# EAGLE design BiasController (EAGLE 7.7.0)
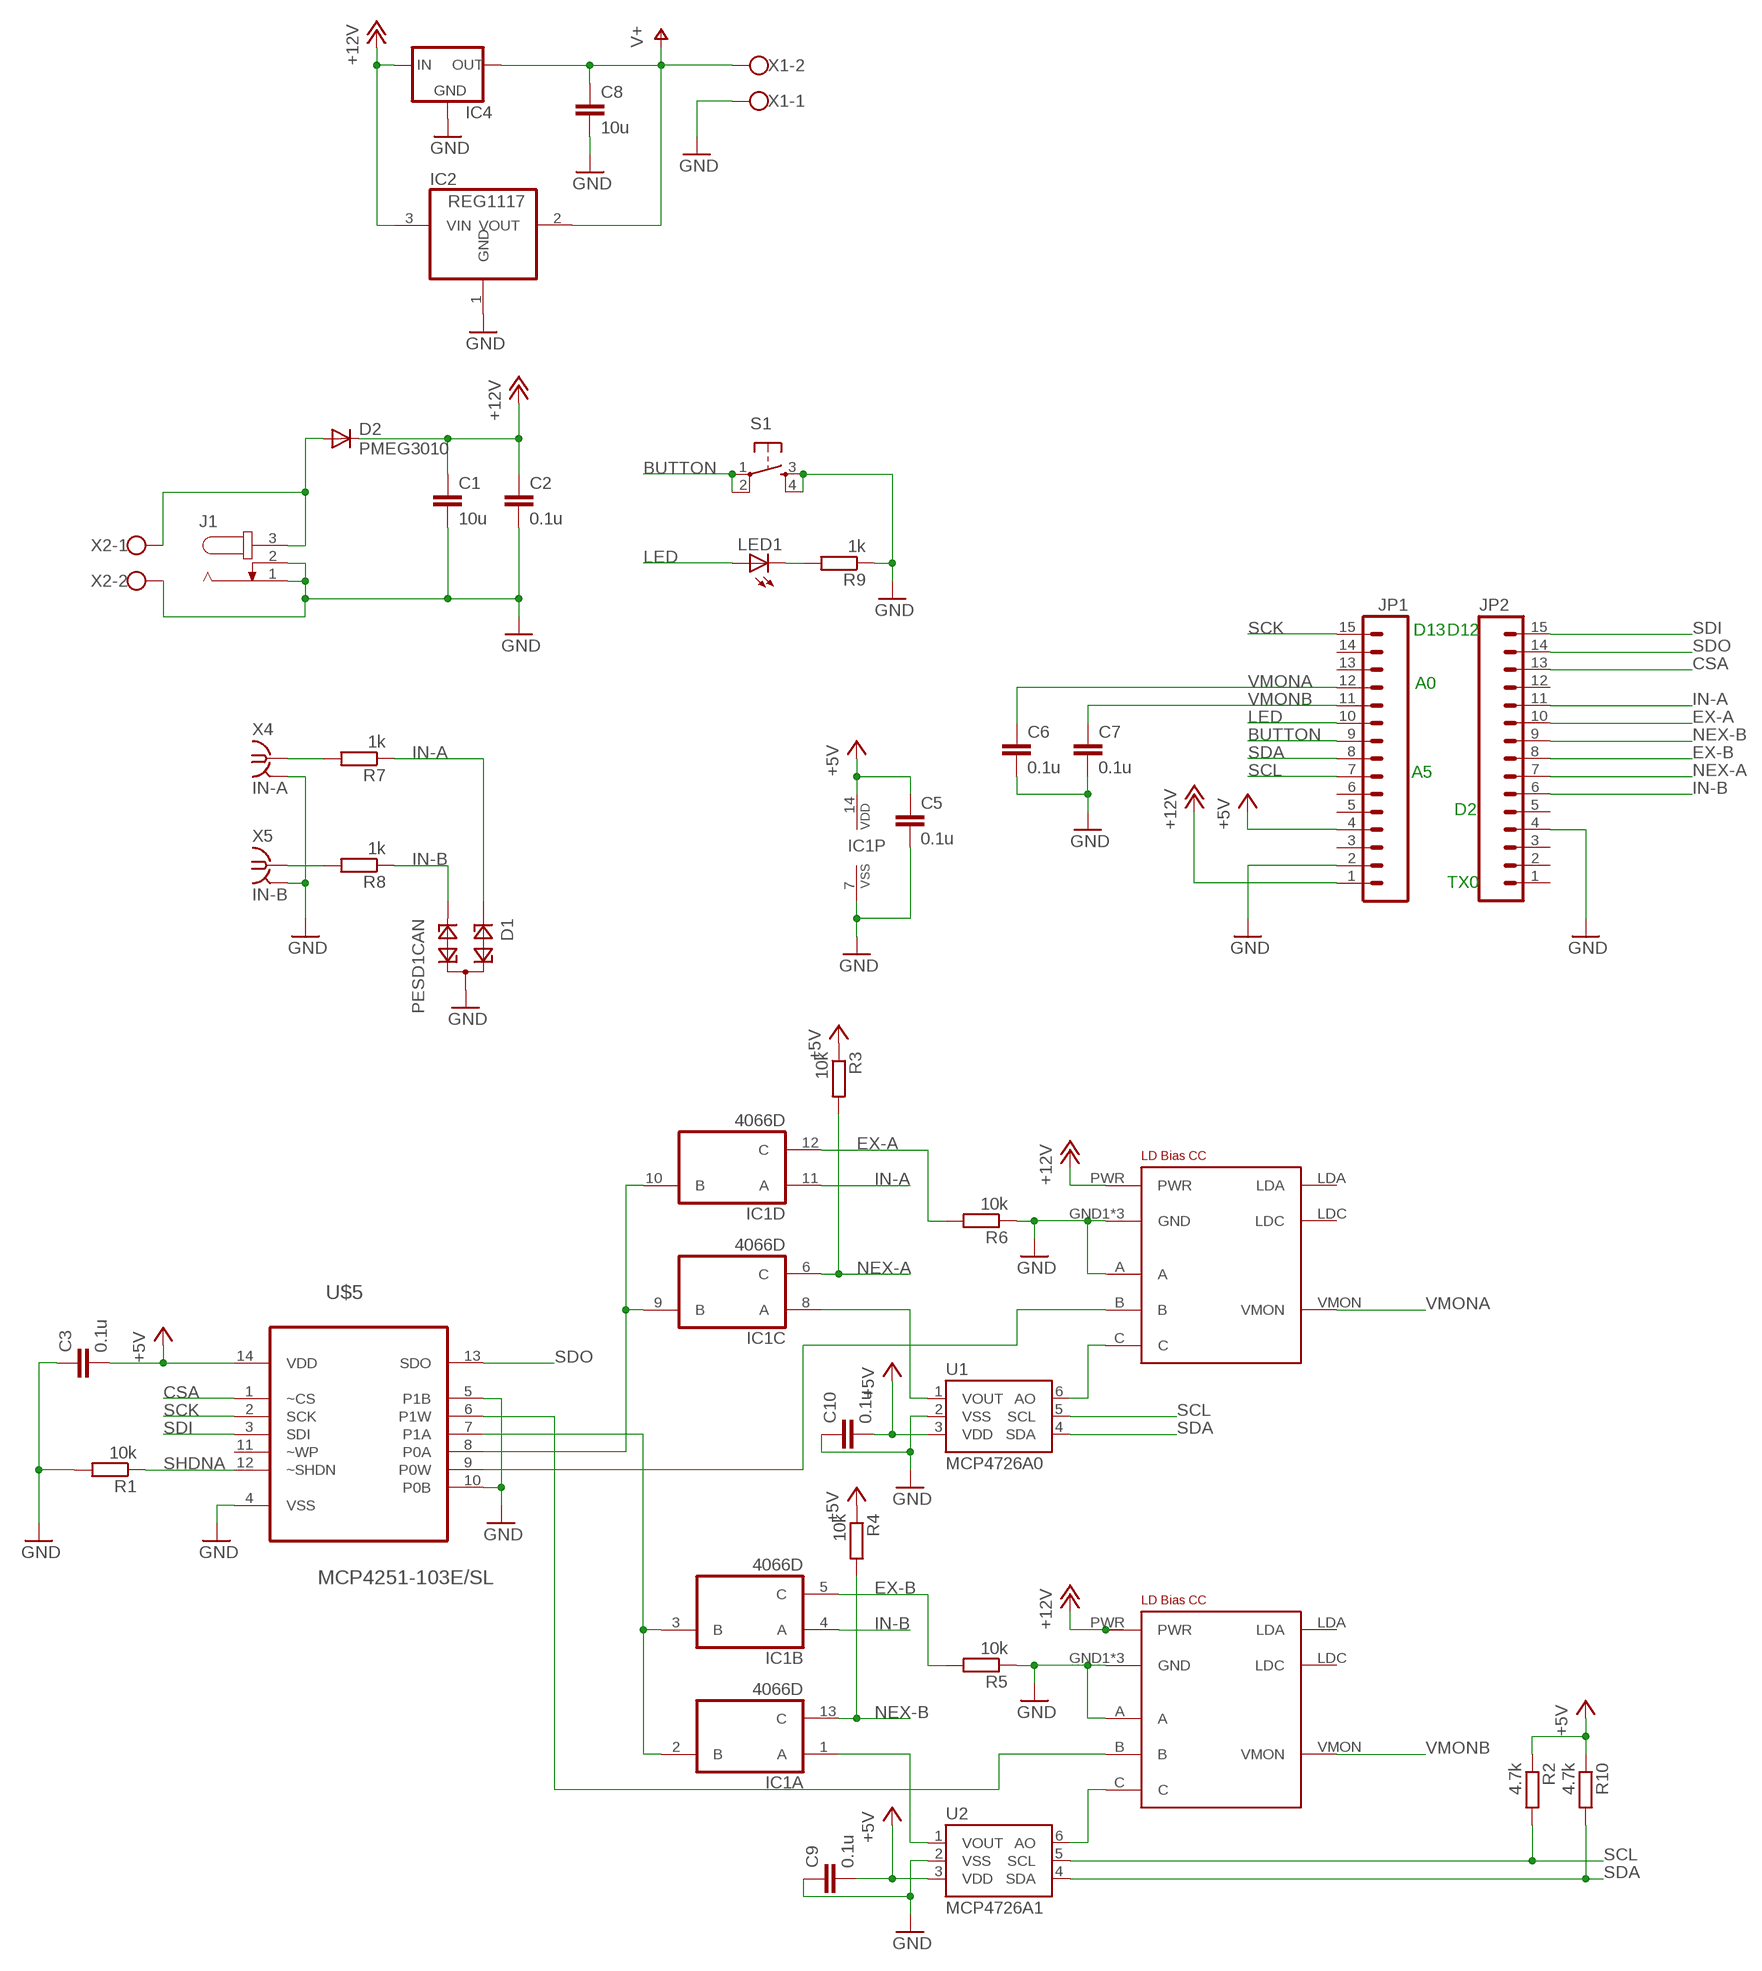
[diagram p0: schematic, sheet 1]

## Parts
C1  10u  C-EUC0805  [C0805]
C2  0.1u  C-EUC0805  [C0805]
C3  0.1u  C-EUC0805  [C0805]
C5  0.1u  C-EUC0805  [C0805]
C6  0.1u  C-EUC0805  [C0805]
C7  0.1u  C-EUC0805  [C0805]
C8  10u  C-EUC0805  [C0805]
C9  0.1u  C-EUC0805  [C0805]
C10  0.1u  C-EUC0805  [C0805]
D1  PESD1CAN  [SOT23]
D2  PMEG3010  DIODESOD  [SOD-323]
IC1  4066D  [SO14]
IC2  REG1117  [SOT223]
IC4  78XXS  [78XXS]
J1  JACK-PLUG0  [SPC4077]
JP1  M15LOCK_LONGPADS  [1X15_LOCK_LONGPADS]
JP2  M15LOCK_LONGPADS  [1X15_LOCK_LONGPADS]
LED1  LED0603  [LED-0603]
R1  10k  R-EU_R0805  [R0805]
R2  4.7k  R-EU_R0805  [R0805]
R3  10k  R-EU_R0805  [R0805]
R4  10k  R-EU_R0805  [R0805]
R5  10k  R-EU_R0805  [R0805]
R6  10k  R-EU_R0805  [R0805]
R7  1k  R-EU_R0805  [R0805]
R8  1k  R-EU_R0805  [R0805]
R9  1k  R-EU_R0805  [R0805]
R10  4.7k  R-EU_R0805  [R0805]
S1  TAC_SWITCHPTH  [TACTILE-PTH]
U1  MCP4726A0  MCP4725SOT-23  [SOT23-6]
U2  MCP4726A1  MCP4725SOT-23  [SOT23-6]
U$1  LDBIASCC  [LDBIASDRIVERCC]
U$2  LDBIASCC  [LDBIASDRIVERCC]
U$5  MCP4251-103E/SL  [SOIC127P600X175-14N]
X1  W237-102  [W237-102]
X2  W237-102  [W237-102]
X4  IN-A  SMA-142-0711-821/826  [J502-ND-142-0711-821/826]
X5  IN-B  SMA-142-0711-821/826  [J502-ND-142-0711-821/826]

## Nets
+5V: C3.2 C5.1 C9.2 C10.2 IC1.14(P:VDD) JP1.4 R2.1 R3.1 R4.1 R10.1 U1.3(VDD) U2.3(VDD) U$5.14(VDD)
+12V: C1.1 C2.1 D2.1(C) IC2.3(VIN) IC4.IN JP1.1 U$1.PWR U$2.PWR
BUTTON: JP1.9 S1.1 S1.2
CSA: JP2.13 U$5.1(~CS)
EX-A: IC1.12(D:C) JP2.10 R6.2
EX-B: IC1.5(B:C) JP2.8 R5.2
GND: C1.2 C2.2 C3.1 C5.2 C6.2 C7.2 C8.2 C9.1 C10.1 D1.3 IC1.7(P:VSS) IC2.1(GND) IC4.GND J1.1 J1.2 JP1.2 JP2.4 R1.2 R5.1 R6.1 R9.1 S1.3 S1.4 U1.2(VSS) U2.2(VSS) U$1.A U$1.GND1(GND) U$1.GND2(GND) U$1.GND3(GND) U$2.A U$2.GND1(GND) U$2.GND2(GND) U$2.GND3(GND) U$5.4(VSS) U$5.5(P1B) U$5.10(P0B) X1.1 X2.2 X4.G@1 X4.G@2 X4.G@3 X4.G@4 X5.G@1 X5.G@2 X5.G@3 X5.G@4
IN-A: D1.1 IC1.11(D:A) JP2.11 R7.1
IN-B: D1.2 IC1.4(B:A) JP2.6 R8.1
LED: JP1.10 LED1.A
N$1: U1.6(AO) U$1.C
N$2: IC1.8(C:A) U1.1(VOUT)
N$3: U$1.B U$5.9(P0W)
N$4: IC1.9(C:B) IC1.10(D:B) U$5.8(P0A)
N$6: IC1.2(A:B) IC1.3(B:B) U$5.7(P1A)
N$7: U2.6(AO) U$2.C
N$9: D2.2(A) J1.3 X2.1
N$10: LED1.C R9.2
N$13: R7.2 X4.1
N$14: R8.2 X5.1
N$19: IC1.1(A:A) U2.1(VOUT)
N$20: U$2.B U$5.6(P1W)
NEX-A: IC1.6(C:C) JP2.7 R3.2
NEX-B: IC1.13(A:C) JP2.9 R4.2
SCK: JP1.15 U$5.2(SCK)
SCL: JP1.7 R2.2 U1.5(SCL) U2.5(SCL)
SDA: JP1.8 R10.2 U1.4(SDA) U2.4(SDA)
SDI: JP2.15 U$5.3(SDI)
SDO: JP2.14 U$5.13(SDO)
SHDNA: R1.1 U$5.12(~SHDN)
V+: C8.1 IC2.2(VOUT) IC4.OUT X1.2
VMONA: C6.1 JP1.12 U$1.VMON
VMONB: C7.1 JP1.11 U$2.VMON
Unconnected: JP1.3 JP1.5 JP1.6 JP1.13 JP1.14 JP2.1 JP2.2 JP2.3 JP2.5 JP2.12 U$1.LDA U$1.LDC U$2.LDA U$2.LDC U$5.11(~WP)

## Notes on the sheet
- D13 | D12
- A0
- A5
- D2
- TX0

## Library data of the parts
C1-C3 C5-C10 = rcl:C-EU: CAPACITOR, European symbol
D1 = diode:PESD1CAN: CAN bus ESD protection diode Source: http://www.nxp.com/documents/data_sheet/PESD1CAN.pdf
D2 = SparkFun:DIODE: Diode These are standard reverse protection diodes and small signal diodes. SMA package can handle up to about 1A. SOD-323 can handle about 200mA. What the SOD-323 package when ordering, there are some mfgs out there that are 5-pin packages.
IC1 = 40xx:4066: Quad bilateral ANALOG SWITCH
IC2 = burr-brown:REG1117: 800mA and 1A Low Dropout (LDO) Positive Regulator 1.8V, 2.5V, 2.85V, 3.3V, 5V, and Adj; MPN: REG1117; OC_FARNELL: 1097566; OC_NEWARK: 14P6981
IC4 = v-reg:78XXS: VOLTAGE REGULATOR
J1 = con-jack:JACK-PLUG: DC POWER JACK Power Jack, DC, Right Angle, Through Hole, Rated 5A at 16VDC, PC Terminals Distributor: Farnell (www.Farnell.de) Drawing: 84N1161.pdf / 84N1162.pdf Manufacturer: SPC Technology (www.spctechnology.com) Type: SPC4077 / SPC 4078; OC_FARNELL: unknown; OC_NEWARK: unknown
JP1 JP2 = SparkFun-Connectors:M15: Header 15 Standard 15-pin 0.1" header. Use with straight break away headers (SKU : PRT-00116), right angle break away headers (PRT-00553), swiss pins (PRT-00743), machine pins (PRT-00117), and female headers (PRT-00115).
LED1 = SparkFun:LED: LEDs Standard schematic elements and footprints for 5mm, 3mm, 1206, and 0603 sized LEDs. 5mm - Spark Fun Electronics SKU : COM-00529 (and others)
R1-R10 = rcl:R-EU_: RESISTOR, European symbol
S1 = SparkFun:TAC_SWITCH: Momentary Switch Button commonly used for reset or general input. Spark Fun Electronics SKU : COM-00097
U1 U2 = SparkFun-AnalogIC:MCP4725: Microchip 12-bit I2C DAC, SOT23-6; PROD_ID: IC-08886; VALUE: MCP4725
U$1 U$2 = Footprint:LDBIASCC
U$5 = Custom:MCP4251-103E/SL: Digital POT; MPN: MCP4251-103E/SL; OC_FARNELL: 1578444; OC_NEWARK: 27M0148; PACKAGE: SOIC-14; SUPPLIER: Microchip
X1 X2 = con-wago-500:W237-102: WAGO SCREW CLAMP; MPN: 237-102; OC_FARNELL: unknown; OC_NEWARK: 70K9898
X4 X5 = con-coax:SMA-: SMA 50 Ohm End Launch Jack Receptacle - Round Contact Johnson Components Source: www.johnsoncomponents.com .. J502-ND.pdf; MF: JOHNSON COMPONENTS; MPN: 142-0711-821; OC_FARNELL: 1019328; OC_NEWARK: 16F3627

## Board
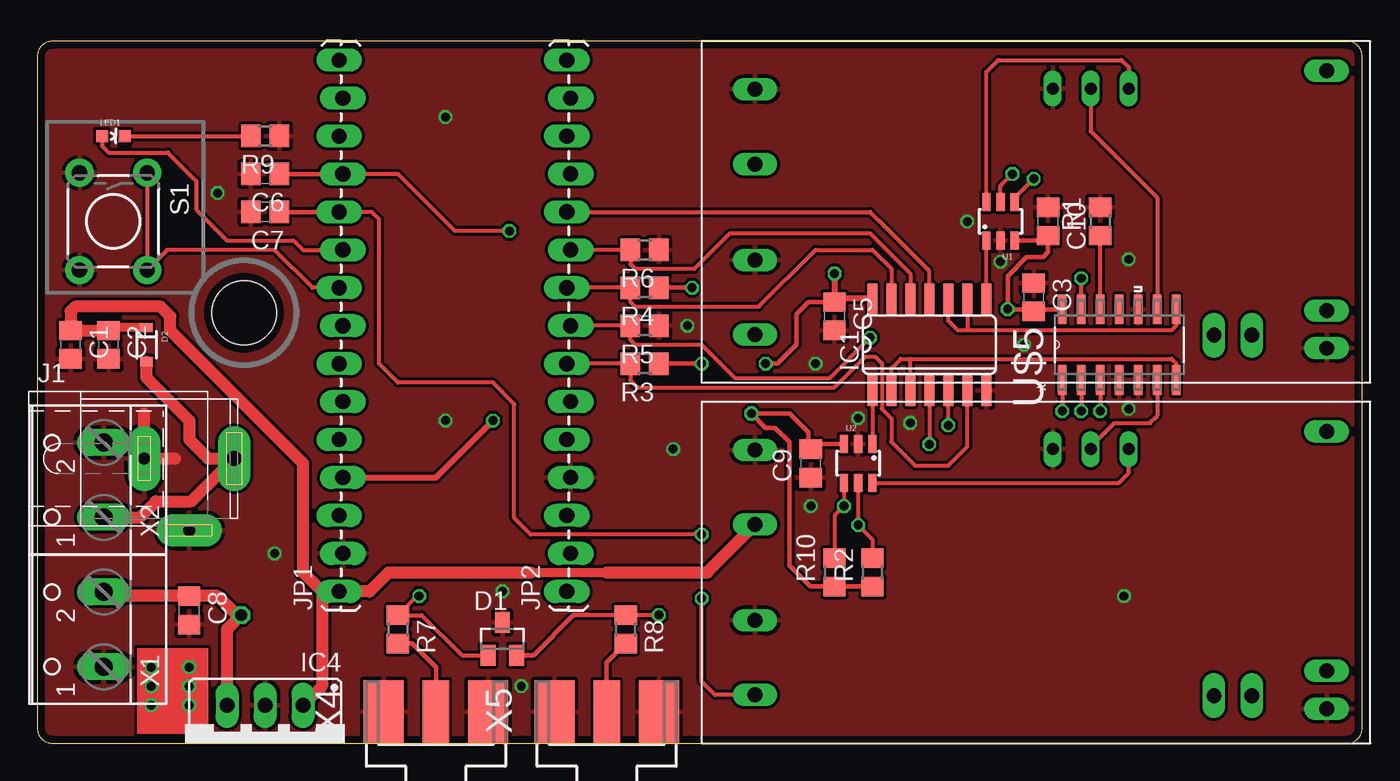
[diagram p1: board, top side]
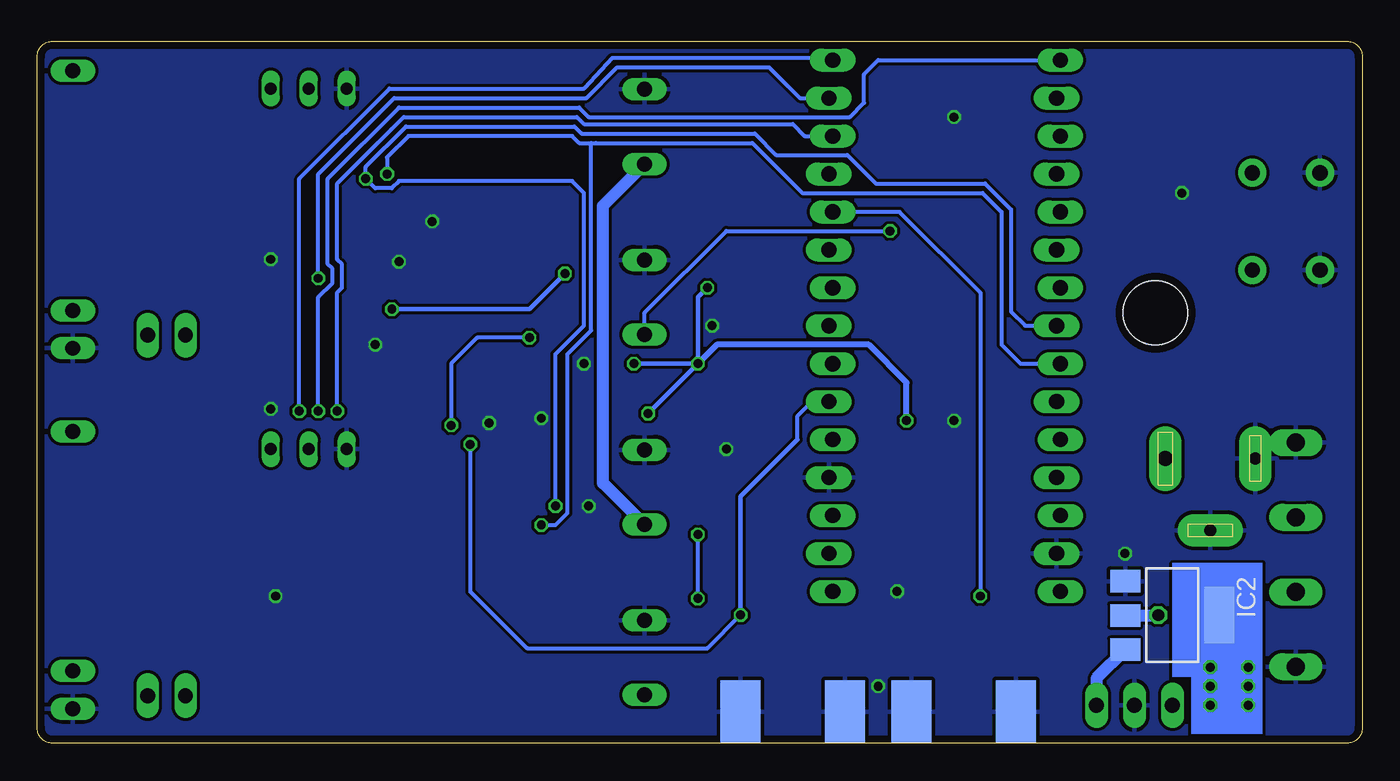
[diagram p2: board, bottom side, seen from below]

Size 88.65 x 46.98 mm. Coordinates in mm from the lower left corner, seen from the top.
Outline: 0,45.98 0,1 arc90 1,0 87.65,0 arc90 88.65,1 88.65,45.98 arc90 87.65,46.98 1,46.98 arc90 0,45.98
Copper layers (1*16): Top 0.035mm / dielectric 1.6mm / Bottom 0.035mm
Design rules "Elecrow_2-layer_PCB_eagle_rule *": minimum track width 6mil, minimum drill 12mil, track to track 8mil, track to pad 8mil, pad to pad 8mil, via to via 8mil, smd to smd 0mil, copper to edge 20mil, drill to drill 10mil, minimum pad ring 6mil, minimum via ring 6mil, stop-mask expansion 0mil, vias tented up to drill 100mil, thermal gap 10mil
Holes 4.3 mm at 13.83,28.81

### Footprints (pad centres in the part's own frame; a part is rotated, then mirrored left to right if it is on the bottom)
C0805 = smd 1.3 x 1.5: 1 -0.95,0; 2 0.95,0
SOT23 = smd 1 x 1.4: 1 -0.95,-1.1; 2 0.95,-1.1; 3 0,1.1
SOD-323 = smd 0.63 x 0.83: 1 -1.15,0; 2 1.15,0
SO14 = smd 0.66 x 2.032: 1 -3.81,-3.073; 2 -2.54,-3.073; 3 -1.27,-3.073; 4 0,-3.073; 5 1.27,-3.073; 6 2.54,-3.073; 7 3.81,-3.073; 8 3.81,3.073; 9 2.54,3.073; 10 1.27,3.073; 11 0,3.073; 12 -1.27,3.073; 13 -2.54,3.073; 14 -3.81,3.073
SOT223 = smd 1.499 x 2.007: 1 -2.261,-3.15; 2 0.025,-3.15; 3 2.311,-3.15 | smd 3.81 x 2.007: 4 0,3.15
78XXS = drill 1.016 long: GND 0,-2.54; IN -2.54,-2.54; OUT 2.54,-2.54
SPC4077 = drill 0.8 pad 2.184 long: 1 -3,0; 2 0,-4.8 | drill 1 pad 2.184 long: 3 3,0
1X15_LOCK_LONGPADS = drill 1.016 long: 1 0,0.127; 2 2.54,-0.127; 3 5.08,0.127; 4 7.62,-0.127; 5 10.16,0.127; 6 12.7,-0.127; 7 15.24,0.127; 8 17.78,-0.127; 9 20.32,0.127; 10 22.86,-0.127; 11 25.4,0.127; 12 27.94,-0.127; 13 30.48,0.127; 14 33.02,-0.127; 15 35.56,0.127
LED-0603 = smd 0.8 x 0.8: A 0,-0.75; C 0,0.75
R0805 = smd 1.3 x 1.5: 1 -0.95,0; 2 0.95,0
TACTILE-PTH = drill 1.016 pad 1.88: 1 -3.251,2.261; 2 3.251,2.261; 3 -3.251,-2.261; 4 3.251,-2.261
SOT23-6 = smd 0.55 x 1.2: 1 0.95,1.3; 2 0,1.3; 3 -0.95,1.3; 4 -0.95,-1.3; 5 0,-1.3; 6 0.95,-1.3
LDBIASDRIVERCC = drill 1 long: 1 36.83,3.175; 2 34.29,3.175; GND1 3.57,19.63; GND2 3.572,8.22; GND3 41.831,2.302; LDA 41.831,4.84; LDC 41.82,20.87; PWR 3.57,14.63; VMON 3.57,3.223 | drill 0.8 long: A 23.495,19.685; B 26.035,19.685; C 28.575,19.685
SOIC127P600X175-14N = smd 1.981 x 0.559: 1 -2.362,3.81; 2 -2.362,2.54; 3 -2.362,1.27; 4 -2.362,0; 5 -2.362,-1.27; 6 -2.362,-2.54; 7 -2.362,-3.81; 8 2.362,-3.81; 9 2.362,-2.54; 10 2.362,-1.27; 11 2.362,0; 12 2.362,1.27; 13 2.362,2.54; 14 2.362,3.81
W237-102 = drill 1.194 long: 1 -2.5,-1.27; 2 2.5,-1.27
J502-ND-142-0711-821/826 = smd 4.191 x 1.778: 1 2.115,0 | smd 4.191 x 2.667: G@1 2.115,3.495; G@2 2.115,-3.495 | smd 4.191 x 2.667 bottom: G@3 2.115,3.495; G@4 2.115,-3.495

### Placement (x,y rotation side)
C1  2.22,26.67 270 top
C2  4.76,26.67 270 top
C3  66.67,29.84 270 top
C5  53.34,28.57 270 top
C6  15.24,38.1 180 top
C7  15.24,35.56 180 top
C8  10.16,8.89 270 top
C9  51.75,18.73 90 top
C10  67.63,34.92 270 top
D1  31.11,6.99 0 top
D2  7.3,26.67 270 top
IC1  59.69,26.67 0 top
IC2  12.7,8.57 270 bottom
IC4  15.24,0 180 top
J1  10.16,19.05 0 top
JP1  20.32,10.16 90 top
JP2  35.56,10.16 90 top
LED1  5.08,40.64 270 top
R1  71.12,34.92 90 top
R2  55.88,11.43 90 top
R3  40.64,25.4 180 top
R4  40.64,30.48 180 top
R5  40.64,27.94 180 top
R6  40.64,33.02 180 top
R7  24.13,7.62 270 top
R8  39.37,7.62 270 top
R9  15.24,40.64 180 top
R10  53.34,11.43 90 top
S1  5.08,34.92 270 top
U1  64.45,34.92 180 top
U2  54.93,18.73 0 top
U$1  44.45,24.13 0 top
U$2  44.45,0 0 top
U$5  72.39,26.67 90 top
X1  3.18,7.62 90 top
X2  3.18,17.62 90 top
X4  26.67,0 90 top
X5  38.1,0 90 top

### Tracks (layer width: path | path; a pad name or v marks a point on that pad's centre or on a via)
+5V  (via drill 0.6)
  Top 0.305: v44.45,25.4 R3.1 | R4.1 v43.81,30.48 | U2.3 52.1,20.03 C9.2 51.59,19.84 51.59,20.8 50.32,22.07 v47.78,22.07 48.74,21.11 49.37,21.11 50.32,20.16 50.32,11.91 51.75,10.48 R10.1 R2.1 | U1.3 67.28,33.62 C10.2 67.63,32.86 67.31,32.54 66.2,32.54 64.93,31.27 v64.93,29.05 64.95,29.03 66.81,29.03 | U$5.14 66.81,29.03 | 66.81,29.03 C3.2 | C5.1 51.59,29.52 50.8,28.73 50.8,26.67 49.53,25.4 v48.74,25.4
  Top 0.406: IC1.14 53.12,29.74 C5.1 v53.34,31.43 | JP1.4 26.67,17.78 v30.48,21.59
  Bottom 0.305: v43.81,30.48 44.45,29.84 v44.45,25.4 | v44.45,25.4 v47.78,22.07 | v48.74,25.4 v44.45,25.4 | v64.93,29.05 55.72,29.05 v53.34,31.43
  Bottom 0.406: v30.48,21.59 30.48,24.13 33.02,26.67 43.18,26.67 v44.45,25.4
+12V
  Top 0.61: 33.02,11.43 38.1,11.43 | D2.1 4.64,27.82 C2.1
  Top 0.813: 19.05,10.16 17.78,11.43 17.78,18.73 8.89,27.62 8.89,28.57 8.26,29.21 2.54,29.21 2.22,28.89 C1.1 C2.1 | 33.02,11.43 23.5,11.43 22.23,10.16 JP1.1 19.05,10.16 | 38.1,11.43 44.82,11.43 U$2.PWR | 19.05,10.16 19.05,3.81 IC4.IN
  Bottom 0.813: IC2.3 17.78,4.33 IC4.IN | U$2.PWR 50.8,17.41 50.8,35.98 U$1.PWR
BUTTON
  Top 0.254: S1.1 S1.2 8.69,33.02 15.88,33.02 18.41,30.48 JP1.9
CSA  (via drill 0.6)
  Top 0.254: U$5.1 v68.58,22.23
  Bottom 0.254: v68.58,22.23 68.58,30.16 68.26,30.48 68.26,32.07 68.58,32.38 68.58,37.47 64.14,41.91 52.55,41.91 52.07,41.43 38.1,41.43 37.31,40.64 JP2.13
EX-A
  Top 0.254: JP2.10 R6.2 39.69,32.06 40,31.75 43.97,31.75 46.35,34.13 55.72,34.13 58.42,31.43 IC1.12
EX-B  (via drill 0.6)
  Top 0.254: R5.2 JP2.8 | R5.2 39.69,27.62 | v55.72,27.15 53.02,24.45 46.67,24.45 44.45,26.67 40,26.67 39.69,26.99 R5.2 | v60.96,21.27 IC1.5
  Bottom 0.254: v55.72,27.15 59.21,27.15 60.96,25.4 v60.96,21.27
GND  (via drill 0.6)
  Top 0.813: 7.14,19.21 7.14,22.07 | 7.3,19.05 9.21,19.05
  other vias: 66.04,26.67 42.54,19.68 72.71,9.84 12.07,36.83 27.3,21.59 43.5,27.94 15.88,12.7 32.38,3.81 31.11,10.16 58.42,21.43 51.75,15.88 54.93,21.75 64.45,32.23 62.23,34.92 52.07,25.4 73.03,22.38 27.3,41.91 73.03,32.38
  pour Bottom: -1.27,48.26 88.9,46.99 88.9,0 0,0
  pour Top: 0,0 -1.27,48.26 88.9,48.26 88.9,0
IN-A  (via drill 0.6)
  Top 0.254: IC1.11 59.69,31.59 57.07,34.21 56.67,34.61 55.72,35.56 JP2.11 | D1.1 28.41,5.88 25.72,8.57 R7.1 25.4,9.84 v25.56,9.84
  Bottom 0.254: v25.56,9.84 25.56,30.16 30.96,35.56 JP2.11
IN-B  (via drill 0.6)
  Top 0.254: IC1.4 v59.69,20
  Top 0.305: 39.05,8.57 v41.59,8.57 | D1.2 33.19,5.88 35.88,8.57 36.83,8.57 R8.1
  Top 0.406: R8.1 39.05,8.57
  Bottom 0.254: 37.78,20.32 37.78,21.91 36.83,22.86 JP2.6 34.29,22.86 | v59.69,20 59.69,10.16 55.88,6.35 43.81,6.35 v41.59,8.57
  Bottom 0.305: 37.78,20.32 41.59,16.51 v41.59,8.57
LED
  Top 0.254: LED1.A 4.33,39.96 4.76,39.53 8.73,39.53 10.64,37.62 10.64,35.72 12.7,33.66 17.14,33.66 17.78,33.02 JP1.10
N$1
  Top 0.254: U1.6 63.5,39.69 63.5,44.93 64.29,45.72 72.55,45.72 73.03,45.24 U$1.C
N$2
  Top 0.254: IC1.8 U1.1
N$3
  Top 0.254: U$1.B 70.48,40.96 74.93,36.51 U$5.9
N$4
  Top 0.254: U$5.8 76.2,27.94 75.88,27.62 62.23,27.62 | 62.23,27.62 61.59,27.62 60.96,28.26 IC1.10 | IC1.9 62.23,27.62
N$6
  Top 0.254: IC1.2 57.15,25.08 57.78,25.72 58.42,25.72 | 58.42,25.72 75.88,25.72 76.2,25.4 U$5.7 | IC1.3 58.42,25.72
N$7
  Top 0.254: U2.6 72.36,17.43 73.03,18.1 U$2.C
N$9
  Top 0.813: 13.34,17.78 13.16,17.32 J1.3 | 13.16,19.98 J1.3 | J1.3 11.43,19.05 10.16,20.32 10.16,21.59 7.3,24.45 D2.2 | X2.1 6.87,15.12 7.94,16.19 10.3,16.19 J1.3
N$10
  Top 0.254: LED1.C R9.2
N$11  (via drill 0.6)
  other vias: 7.62,2.54
N$12  (via drill 0.6)
  other vias: 10.16,2.54
N$13
  Top 0.305: R7.2 25.08,6.67 26.67,5.08 X4.1
N$14
  Top 0.305: X5.1 38.1,5.4 R8.2
N$15  (via drill 0.6)
  other vias: 7.62,3.81
N$16  (via drill 0.6)
  other vias: 10.16,3.81
N$17  (via drill 0.6)
  other vias: 10.16,5.08
N$18  (via drill 0.6)
  other vias: 7.62,5.08
N$19
  Top 0.254: IC1.1 U2.1
N$20
  Top 0.254: U$5.6 74.93,21.91 74.45,21.43 72.07,21.43 70.48,19.84 U$2.B
NEX-A
  Top 0.254: JP2.7 R3.2 39.69,24.29 40.16,23.81 53.34,23.81 55.4,25.88 56.04,25.88 56.51,25.4 56.51,22.38 57.15,21.75 57.15,20.16 58.74,18.57 60.96,18.57 62.23,19.84 IC1.6
NEX-B
  Top 0.254: R4.2 JP2.9 | R4.2 39.69,30.16 | IC1.13 57.15,31.75 55.88,33.02 52.07,33.02 48.26,29.21 40,29.21 39.69,29.53 R4.2
SCK  (via drill 0.6)
  Top 0.254: U$5.2 v69.85,22.23
  Bottom 0.254: v69.85,22.23 69.85,29.84 68.9,30.8 68.9,31.75 69.22,32.07 69.22,37.78 64.45,42.55 52.39,42.55 51.75,41.91 34.29,41.91 33.34,42.86 33.34,44.77 32.38,45.72 JP1.15
SCL  (via drill 0.6)
  Top 0.254: U1.5 64.45,37.31 v65.25,38.1 | U2.5 v54.93,14.61 55.88,13.65 R2.2
  Bottom 0.254: JP1.7 22.86,25.4 24.13,26.67 24.13,35.56 25.4,36.83 37.46,36.83 40.8,40.16 51.28,40.16 51.59,40.16 | 51.59,40.16 52.39,40.16 52.86,40.64 63.82,40.64 65.25,39.21 v65.25,38.1 | v54.93,14.61 53.97,14.61 53.18,15.4 53.18,26.04 51.59,27.62 51.59,40.16
SDA  (via drill 0.6)
  Top 0.254: U1.4 65.4,36.51 v66.67,37.78 | U2.4 v53.98,15.88 v53.97,15.88 53.34,15.24 R10.2
  Bottom 0.254: JP1.8 22.54,27.94 23.5,28.89 23.5,35.72 25.24,37.47 32.54,37.47 34.45,39.37 39.21,39.37 40.64,40.8 52.23,40.8 52.7,41.27 63.98,41.27 66.67,38.58 v66.67,37.78 66.04,37.15 64.93,37.15 64.45,37.62 52.86,37.62 52.07,36.83 52.07,27.94 53.97,26.04 v53.97,15.88
SDI  (via drill 0.6)
  Top 0.254: U$5.3 v71.12,22.23
  Bottom 0.254: v71.12,22.23 71.12,37.78 65.09,43.81 52.07,43.81 50.16,45.88 35.59,45.88 JP2.15
SDO  (via drill 0.6)
  Top 0.254: U$5.13 v69.85,31.11
  Bottom 0.254: v69.85,31.11 69.85,38.1 64.77,43.18 51.91,43.18 49.85,45.24 39.69,45.24 37.62,43.18 JP2.14
SHDNA
  Top 0.254: U$5.12 R1.1
V+  (via drill 0.8)
  Top 0.813: C8.1 12.07,9.84 13.34,8.57 v13.65,8.57 12.7,7.62 IC4.OUT | C8.1 | C8.1 4.48,9.84 X1.2
  Bottom 0.813: IC2.2 13.68,8.55 v13.65,8.57
VMONA  (via drill 0.6)
  Top 0.254: v31.59,34.29 27.94,34.29 24.13,38.1 JP1.12
  Top 0.305: C6.1 JP1.12
  Bottom 0.254: U$1.VMON 48.02,28.82 42.54,34.29 v31.59,34.29
VMONB  (via drill 0.6)
  Top 0.254: U$2.VMON 45.35,3.22 44.45,4.13 v44.45,9.68 | v44.45,13.97 33.02,13.97 31.91,15.08 31.91,22.7 30.48,24.13 24.13,24.13 22.86,25.4 22.86,35.08 22.38,35.56 JP1.11
  Top 0.305: C7.1 JP1.11
  Bottom 0.254: v44.45,9.68 v44.45,13.97
(copper drawn outside any net)
  shapes: Bottom area x2, Top area x1

### Text on the board
tStop: LDBiasController | Mitchell A. Cox
tDocu: * | LD On/Off | LDBiasDriver CC | B | B | * | +5-16V In | * | LDBiasDriver CC | + | A | A | Vbias = 2.5 x DAC x DIV | A | B | Vbias = Vin x DIV | Vbias = Vin x DIV | Vbias = Vin x DIV | 5V Out
bDocu: +